# Altium project controller.PrjPcb
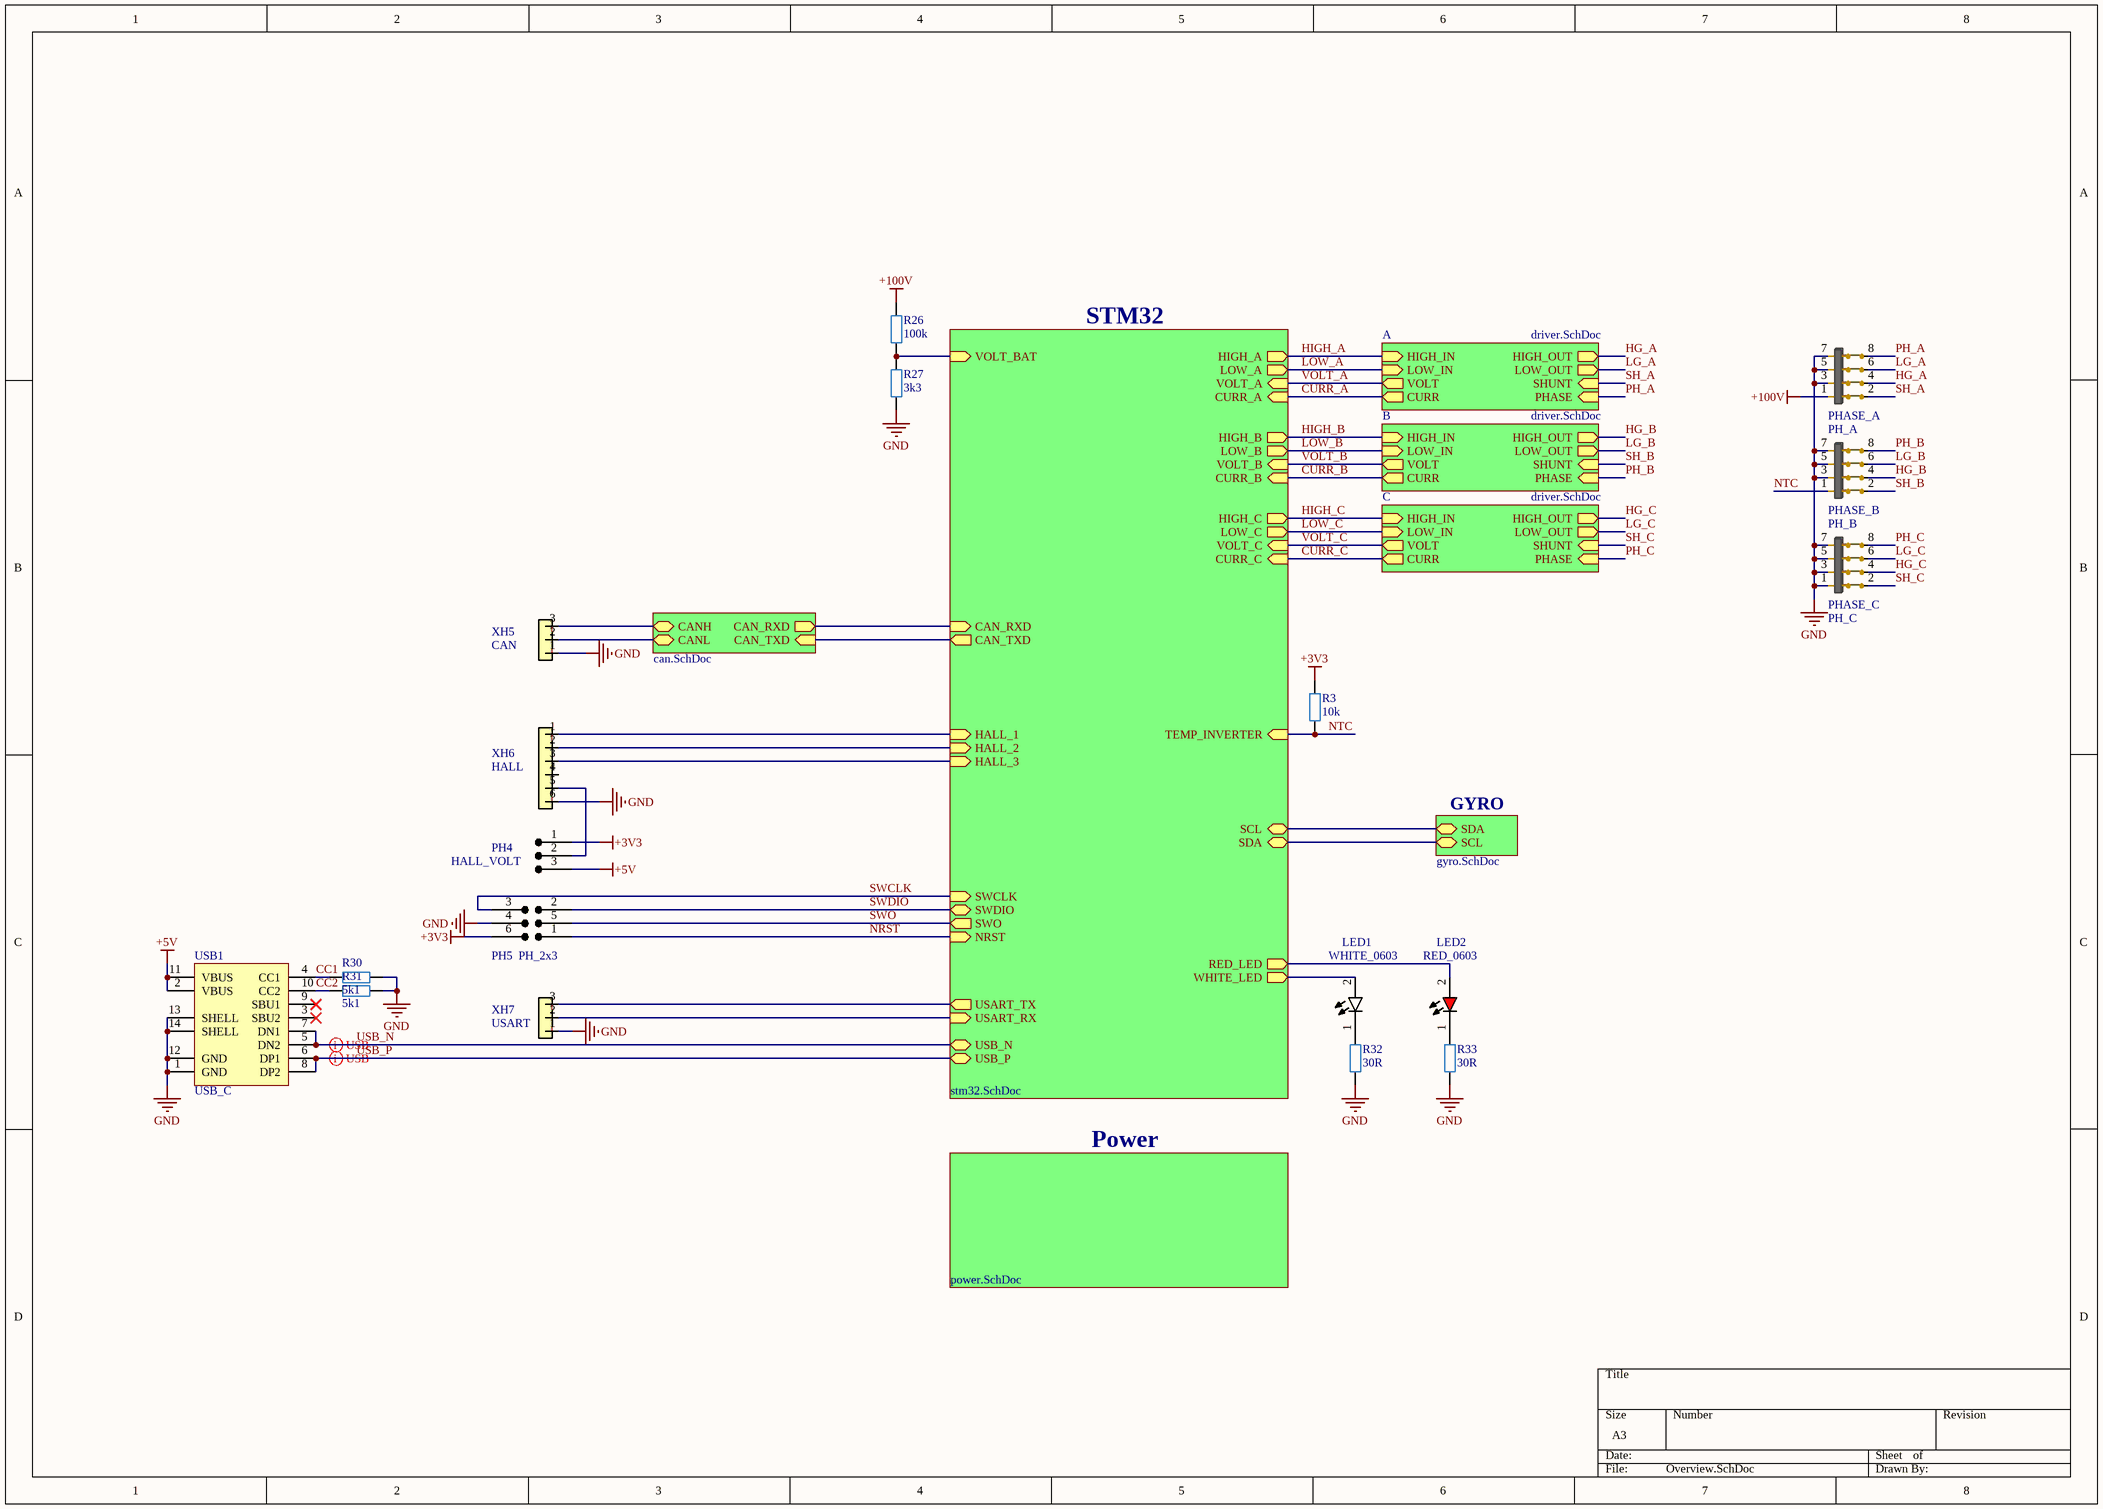
[diagram p0: Overview.SchDoc]
6 sheets, 84 parts. Net scope: hierarchical (ports join the sheet entries above them; power ports are global).
Board file: controllerboard.PcbDoc
Sheets:
  Overview.SchDoc
    STM32 = stm32.SchDoc
    CAN = can.SchDoc
    Power = power.SchDoc
    A = driver.SchDoc
    B = driver.SchDoc
    C = driver.SchDoc
    GYRO = gyro.SchDoc

## Sheet Overview.SchDoc
size A3; SheetNumber: 1; SheetTotal: 6

### Parts
LED1  WHITE_0603  [WHITE_0603]
LED2  RED_0603  [RED_0603]
PH4  HALL_VOLT  [PH_1x3]
PH5  PH_2x3  [PH_2x3]
PH_A  PHASE_A  [PH_2x4_M]
PH_B  PHASE_B  [PH_2x4_M]
PH_C  PHASE_C  [PH_2x4_M]
R3  10k  [RES_0603]
R26  100k  [RES_0603]
R27  3k3  [RES_0603]
R30  5k1  [RES_0603]
R31  5k1  [RES_0603]
R32  30R  [RES_0603]
R33  30R  [RES_0603]
USB1  USB_C  [USB_C]
XH5  CAN  [XY-XHB2.54-3A21]
XH6  HALL  [XY-XHB2.54-6A21]
XH7  USART  [XY-XHB2.54-3A21]

### Sub-sheets
A = driver.SchDoc: HIGH_IN (in), LOW_IN (in), HIGH_OUT (out), LOW_OUT (out), VOLT (out), SHUNT (in), PHASE (in), CURR (out)
B = driver.SchDoc: HIGH_IN (in), LOW_IN (in), HIGH_OUT (out), LOW_OUT (out), VOLT (out), SHUNT (in), PHASE (in), CURR (out)
C = driver.SchDoc: HIGH_IN (in), LOW_IN (in), HIGH_OUT (out), LOW_OUT (out), VOLT (out), SHUNT (in), PHASE (in), CURR (out)
CAN = can.SchDoc: CAN_TXD (in), CAN_RXD (out), CANH (bidir), CANL (bidir)
GYRO = gyro.SchDoc: SDA (bidir), SCL (bidir)
Power = power.SchDoc: no entries
STM32 = stm32.SchDoc: VOLT_A (in), VOLT_B (in), VOLT_C (in), CURR_A (in), CURR_B (in), CURR_C (in), HIGH_A (out), HIGH_B (out), HIGH_C (out), LOW_A (out), LOW_B (out), HALL_1 (in), HALL_2 (in), CAN_RXD (in), USART_RX (in), RED_LED (out), WHITE_LED (out), SWO (out), HALL_3 (in), USB_N (bidir), USB_P (bidir), SWDIO (bidir), NRST (in), CAN_TXD (out), USART_TX (out), SWCLK (in), VOLT_BAT (in), TEMP_INVERTER (in), LOW_C (out), SCL (bidir), SDA (bidir)

### Nets
+3V3: PH4.1 PH5.6 R3.2
+5V: PH4.3 USB1.2(VBUS) USB1.11(VBUS)
+100V: PH_A.1 R26.2
GND: PH5.4 PH_A.3 PH_A.5 PH_A.7 PH_B.3 PH_B.5 PH_B.7 PH_C.1 PH_C.3 PH_C.5 PH_C.7 R27.1 R30.2 R31.2 R32.1 R33.1 USB1.1(GND) USB1.12(GND) USB1.13(SHELL) USB1.14(SHELL) XH5.1 XH6.6 XH7.1
CAN_RXD: sheet STM32/CAN_RXD, sheet CAN/CAN_RXD
CAN_TXD: sheet STM32/CAN_TXD, sheet CAN/CAN_TXD
CANH: XH5.3 ; sheet CAN/CANH
CANL: XH5.2 ; sheet CAN/CANL
CC1: R30.1 USB1.4(CC1)
CC2: R31.1 USB1.10(CC2)
CURR_A: sheet STM32/CURR_A, sheet A/CURR
CURR_B: sheet STM32/CURR_B, sheet B/CURR
CURR_C: sheet STM32/CURR_C, sheet C/CURR
HG_A: PH_A.4 ; sheet A/HIGH_OUT
HG_B: PH_B.4 ; sheet B/HIGH_OUT
HG_C: PH_C.4 ; sheet C/HIGH_OUT
HIGH_A: sheet STM32/HIGH_A, sheet A/HIGH_IN
HIGH_B: sheet STM32/HIGH_B, sheet B/HIGH_IN
HIGH_C: sheet STM32/HIGH_C, sheet C/HIGH_IN
LG_A: PH_A.6 ; sheet A/LOW_OUT
LG_B: PH_B.6 ; sheet B/LOW_OUT
LG_C: PH_C.6 ; sheet C/LOW_OUT
LOW_A: sheet STM32/LOW_A, sheet A/LOW_IN
LOW_B: sheet STM32/LOW_B, sheet B/LOW_IN
LOW_C: sheet STM32/LOW_C, sheet C/LOW_IN
NRST: PH5.1 ; sheet STM32/NRST
NTC: PH_B.1 R3.1 ; sheet STM32/TEMP_INVERTER
PH_A: PH_A.8 ; sheet A/PHASE
PH_B: PH_B.8 ; sheet B/PHASE
PH_C: PH_C.8 ; sheet C/PHASE
SH_A: PH_A.2 ; sheet A/SHUNT  [project net SH]
SH_B: PH_B.2 ; sheet B/SHUNT  [project net SH]
SH_C: PH_C.2 ; sheet C/SHUNT  [project net SH]
SWCLK: PH5.3 ; sheet STM32/SWCLK
SWDIO: PH5.2 ; sheet STM32/SWDIO
SWO: PH5.5 ; sheet STM32/SWO
USB_N: USB1.5(DN2) USB1.7(DN1) ; sheet STM32/USB_N
USB_P: USB1.6(DP1) USB1.8(DP2) ; sheet STM32/USB_P
VOLT_A: sheet STM32/VOLT_A, sheet A/VOLT
VOLT_B: sheet STM32/VOLT_B, sheet B/VOLT
VOLT_C: sheet STM32/VOLT_C, sheet C/VOLT
NetLED1_1: LED1.1(K) R32.2
NetLED1_2: LED1.2(A) ; sheet STM32/WHITE_LED
NetLED2_1: LED2.1(K) R33.2
NetLED2_2: LED2.2(A) ; sheet STM32/RED_LED
NetPH4_2: PH4.2 XH6.5
NetR26_1: R26.1 R27.2 ; sheet STM32/VOLT_BAT
NetU1_18: XH6.1 ; sheet STM32/HALL_1
NetU1_19: XH6.2 ; sheet STM32/HALL_2
NetU1_20: XH6.3 ; sheet STM32/HALL_3
NetU1_21: sheet STM32/SCL, sheet GYRO/SDA
NetU1_22: sheet STM32/SDA, sheet GYRO/SCL
NetU1_42: XH7.3 ; sheet STM32/USART_TX
NetU1_43: XH7.2 ; sheet STM32/USART_RX

Not connected (* = marked no-connect by the designer): USB1 3(SBU2)* 9(SBU1)*; XH6 4

### Layout directives
differential pair: USB_N, USB_P

### Library data of the parts
LED1 = WHITE_0603: 20mA 780mcd Yellow lens -20℃~+85℃ Positive Stick White 130° 70mW 3.3V 0603 LED Indication - Discrete ROHS; Mfr.: XINGLIGHT; Mfr. Part: XL-1608WWC-06; LCSC: C965810; Package: 0603
LED2 = RED_0603: 20mA 330mcd Colorless Transparent Lens -20℃~+85℃ Positive Stick 620nm~630nm Red 120° 50mW 2.3V 0603 LED Indication - Discrete ROHS; Mfr.: XINGLIGHT; Mfr. Part: XL-1608SURC-06; LCSC: C965799; Package: 0603
PH4 = PH_1x3: 2.54mm Pin Headers; Mfr. Part: 2.54-1*3P; Mfr.: BOOMELE(Boom Precision Elec); LCSC: C49257; Package: Plugin,P=2.54mm
PH5 = PH_2x3: 2.54mm Pin Headers
PH_A PH_B PH_C = PH_2x4_M: Policy 2.5mm 8P 6mm -40℃~+105℃ 2.54mm Double Row Black Brass 2x4P Push-Pull,P=2.54mm Pin Headers ROHS; Mfr. Part: PH2.54-07-04PWS; Mfr.: XUNPU; LCSC: C7501618
  PH_A: ClassName: A
  PH_B: ClassName: B
  PH_C: ClassName: C
R3 R26 R27 R30-R33 = RES_0603: 100mW Thick Film Resistors; Voltage Rating: *; Mfr. Part: *; Package: 0603; LCSC: *; Mfr.: *
USB1 = USB_C: Mfr. Part: TYPE-C 16PIN 2MD(073); Mfr.: SHOU HAN; LCSC: C2765186; Package: SMD
XH5 XH7 = XY-XHB2.54-3A21: 1x3P 3P 1 2.54mm 2.54mm 3 -25℃~+85℃ 2A Bend-in Push-Pull,P=2.54mm Wire To Board Connector ROHS; Mfr.: XYECONN; Mfr. Part: XY-XHB2.54-3A21; LCSC: C19271396
XH6 = XY-XHB2.54-6A21: 1x6P 6P 1 2.54mm 2.54mm 6 -25℃~+85℃ 2A Bend-in Push-Pull,P=2.54mm Wire To Board Connector ROHS; Mfr.: XYECONN; Mfr. Part: XY-XHB2.54-6A21; LCSC: C19271399

## Sheet stm32.SchDoc
size A3; SheetNumber: 2; SheetTotal: 6
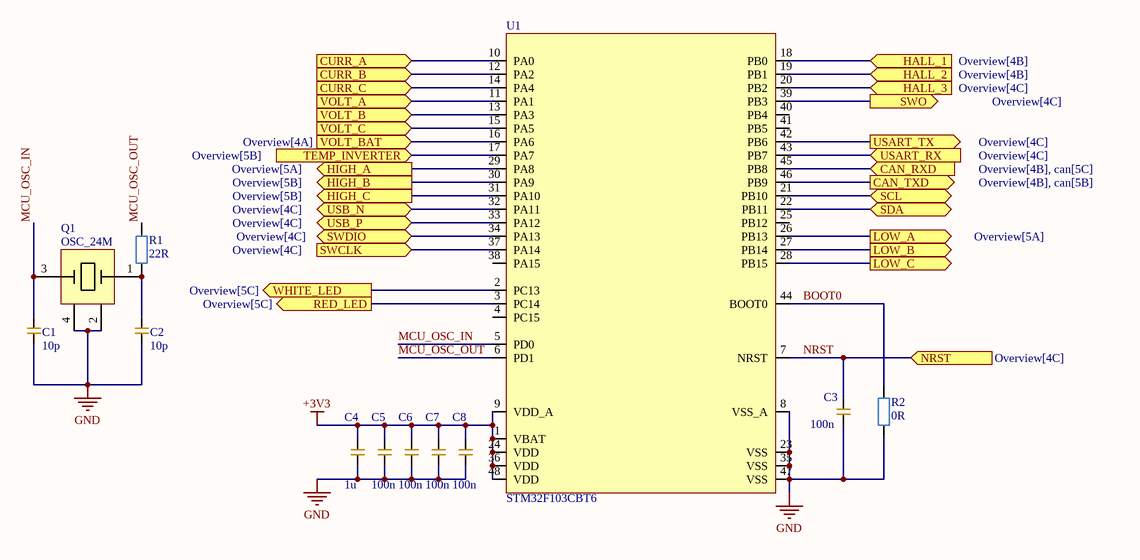
[diagram p1: stm32.SchDoc]

### Parts
C1  10p  [CAP_0603]
C2  10p  [CAP_0603]
C3  100n  [CAP_0603]
C4  1u  [CAP_0603]
C5  100n  [CAP_0603]
C6  100n  [CAP_0603]
C7  100n  [CAP_0603]
C8  100n  [CAP_0603]
Q1  OSC_24M  [OSC_24M]
R1  22R  [RES_0603]
R2  0R  [RES_0603]
U1  STM32F103CBT6  [STM32F103CBT6]

### Ports
CAN_RXD (in, see Overview[4B], can[5C]), CAN_TXD (out, see Overview[4B], can[5B]), CURR_A (in, see Overview[5B]), CURR_B (in, see Overview[5B]), CURR_C (in, see Overview[5B]), HALL_1 (in, see Overview[4B]), HALL_2 (in, see Overview[4B]), HALL_3 (in, see Overview[4C]), HIGH_A (out, see Overview[5A]), HIGH_B (out, see Overview[5B]), HIGH_C (out, see Overview[5B]), LOW_A (out, see Overview[5A]), LOW_B (out, see Overview[5B]), LOW_C (out, see Overview[5B]), NRST (in, see Overview[4C]), RED_LED (out, see Overview[5C]), SCL (bidir), SDA (bidir), SWCLK (in, see Overview[4C]), SWDIO (bidir, see Overview[4C]), SWO (out, see Overview[4C]), TEMP_INVERTER (in, see Overview[5B]), USART_RX (in, see Overview[4C]), USART_TX (out, see Overview[4C]), USB_N (bidir, see Overview[4C]), USB_P (bidir, see Overview[4C]), VOLT_A (in, see Overview[5B]), VOLT_B (in, see Overview[5B]), VOLT_BAT (in, see Overview[4A]), VOLT_C (in, see Overview[5B]), WHITE_LED (out, see Overview[5C])

### Nets
+3V3: C4.2 C5.2 C6.2 C7.2 C8.2 U1.1(VBAT) U1.9(VDD_A) U1.24(VDD) U1.36(VDD) U1.48(VDD)
GND: C1.1 C2.1 C3.1 C4.1 C5.1 C6.1 C7.1 C8.1 Q1.2 Q1.4 R2.1 U1.8(VSS_A) U1.23(VSS) U1.35(VSS) U1.47(VSS)
BOOT0: R2.2 U1.44(BOOT0)
CAN_RXD: U1.45(PB8) ; port CAN_RXD
CAN_TXD: U1.46(PB9) ; port CAN_TXD
CURR_A: U1.10(PA0) ; port CURR_A
CURR_B: U1.12(PA2) ; port CURR_B
CURR_C: U1.14(PA4) ; port CURR_C
HIGH_A: U1.29(PA8) ; port HIGH_A
HIGH_B: U1.30(PA9) ; port HIGH_B
HIGH_C: U1.31(PA10) ; port HIGH_C
LOW_A: U1.26(PB13) ; port LOW_A
LOW_B: U1.27(PB14) ; port LOW_B
LOW_C: U1.28(PB15) ; port LOW_C
MCU_OSC_IN: C1.2 Q1.3 U1.5(PD0)
MCU_OSC_OUT: R1.2 U1.6(PD1)
NRST: C3.2 U1.7(NRST) ; port NRST
NTC: U1.17(PA7) ; port TEMP_INVERTER
SWCLK: U1.37(PA14) ; port SWCLK
SWDIO: U1.34(PA13) ; port SWDIO
SWO: U1.39(PB3) ; port SWO
USB_N: U1.32(PA11) ; port USB_N
USB_P: U1.33(PA12) ; port USB_P
VOLT_A: U1.11(PA1) ; port VOLT_A
VOLT_B: U1.13(PA3) ; port VOLT_B
VOLT_C: U1.15(PA5) ; port VOLT_C
NetC2_2: C2.2 Q1.1 R1.1
NetLED1_2: U1.2(PC13) ; port WHITE_LED
NetLED2_2: U1.3(PC14) ; port RED_LED
NetR26_1: U1.16(PA6) ; port VOLT_BAT
NetU1_18: U1.18(PB0) ; port HALL_1
NetU1_19: U1.19(PB1) ; port HALL_2
NetU1_20: U1.20(PB2) ; port HALL_3
NetU1_21: U1.21(PB10) ; port SCL
NetU1_22: U1.22(PB11) ; port SDA
NetU1_42: U1.42(PB6) ; port USART_TX
NetU1_43: U1.43(PB7) ; port USART_RX

Not connected (* = marked no-connect by the designer): U1 4(PC15) 25(PB12) 38(PA15) 40(PB4) 41(PB5)

### Library data of the parts
C1-C8 = CAP_0603: Multilayer Ceramic Capacitors MLCC - SMD/SMT ROHS; Mfr.: *; Voltage Rating: *; Package: 0603; LCSC: *; Mfr. Part: *
Q1 = OSC_24M: Crystal 24Mhz; Manufacturer Part: X322524MOB4SI; LCSC: C70590; ComponentLink1Description: Datasheet; ComponentLink1URL: https://www.lcsc.com/datasheet/lcsc_datasheet_2403291504_YXC-Crystal-Oscillators-X322524MOB4SI_C70590.pdf
R1 R2 = RES_0603: 100mW Thick Film Resistors; Voltage Rating: *; Mfr. Part: *; Package: 0603; LCSC: *; Mfr.: *
U1 = STM32F103CBT6: Mainstream enhanced ARM Cortex-M3 MCU, featuring 128 KB Flash, 72 MHz CPU, motor control, USB, and CAN.; Mfr.: STMicroelectronics; Mfr. Part: STM32F103CBT6; LCSC: C8304

## Sheet can.SchDoc
size A3; SheetNumber: 5; SheetTotal: 6
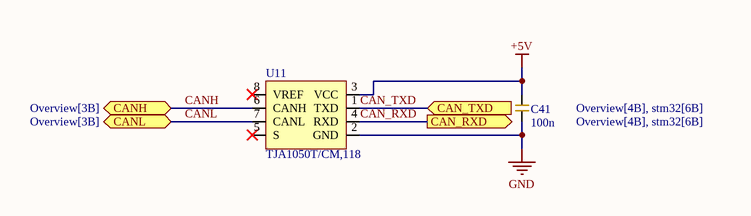
[diagram p2: can.SchDoc]

### Parts
C41  100n  [CAP_0603]
U11  TJA1050T/CM,118  [TJA1050T/CM,118]

### Ports
CAN_RXD (out, see Overview[4B], stm32[6B]), CAN_TXD (in, see Overview[4B], stm32[6B]), CANH (bidir, see Overview[3B]), CANL (bidir, see Overview[3B])

### Nets
+5V: C41.2 U11.3(VCC)
GND: C41.1 U11.2(GND)
CAN_RXD: U11.4(RXD) ; port CAN_RXD
CAN_TXD: U11.1(TXD) ; port CAN_TXD
CANH: U11.6(CANH) ; port CANH
CANL: U11.7(CANL) ; port CANL

Not connected (* = marked no-connect by the designer): U11 5(S)* 8(VREF)*

### Library data of the parts
C41 = CAP_0603: as C1 on sheet stm32; Mfr.: *; Voltage Rating: *; Package: 0603; LCSC: *; Mfr. Part: *
U11 = TJA1050T/CM,118: SOP-8 CAN Transceivers ROHS; Mfr.: NXP Semicon; Mfr. Part: TJA1050T/CM,118; LCSC: C6952

## Sheet power.SchDoc
size A3; SheetNumber: 3; SheetTotal: 5
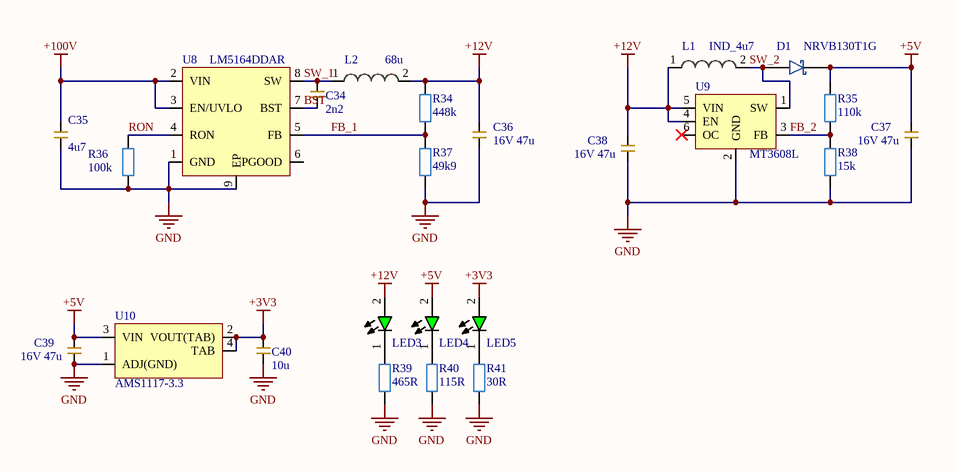
[diagram p3: power.SchDoc]

### Parts
C34  2n2  [CAP_0603]
C35  4u7  [FS32X475K101EGG]
C36  16V 47u  [CAP_1210]
C37  16V 47u  [CAP_1210]
C38  16V 47u  [CAP_1210]
C39  16V 47u  [CAP_1210]
C40  10u  [CAP_0603]
D1  NRVB130T1G  [NRVB130T1G]
L1  IND_4u7  [FTC252010S4R7MBCA]
L2  68u  [SMMS0650-680M]
LED3  GREEN_0603  [GREEN_0603]  (value not drawn)
LED4  GREEN_0603  [GREEN_0603]  (value not drawn)
LED5  GREEN_0603  [GREEN_0603]  (value not drawn)
R34  448k  [RES_0603]
R35  110k  [RES_0603]
R36  100k  [RES_0603]
R37  49k9  [RES_0603]
R38  15k  [RES_0603]
R39  465R  [RES_0603]
R40  115R  [RES_0603]
R41  30R  [RES_0603]
U8  LM5164DDAR  [LM5164DDAR]
U9  MT3608L  [MT3608L]
U10  AMS1117-3.3  [AMS1117-3.3]

### Nets
+3V3: C40.2 LED5.2(A) U10.2(VOUT(TAB)) U10.4(TAB)
+5V: C37.2 C39.2 D1.1 LED4.2(A) R35.2 U10.3(VIN)
+12V: C36.2 C38.2 L1.1 L2.2 LED3.2(A) R34.2 U9.4(EN) U9.5(VIN)
+100V: C35.2 U8.2(VIN) U8.3(EN/UVLO)
GND: C35.1 C36.1 C37.1 C38.1 C39.1 C40.1 R36.1 R37.1 R38.1 R39.1 R40.1 R41.1 U8.1(GND) U8.9(EP) U9.2(GND) U10.1(ADJ(GND))
BST: C34.1 U8.7(BST)
FB_1: R34.1 R37.2 U8.5(FB)
FB_2: R35.1 R38.2 U9.3(FB)
RON: R36.2 U8.4(RON)
SW_1: C34.2 L2.1 U8.8(SW)
SW_2: D1.2 L1.2 U9.1(SW)
NetLED3_1: LED3.1(K) R39.2
NetLED4_1: LED4.1(K) R40.2
NetLED5_1: LED5.1(K) R41.2

Not connected (* = marked no-connect by the designer): U8 6(PGOOD); U9 6(OC)*

### Library data of the parts
C34 C40 = CAP_0603: as C1 on sheet stm32; Mfr.: *; Voltage Rating: *; Package: 0603; LCSC: *; Mfr. Part: *
  C34: ClassName: DCDC100
  C40: ClassName: LINREG
C35 = 4u7: 100V 4.7uF X7R ±10% 1210 Multilayer Ceramic Capacitors MLCC - SMD/SMT ROHS; Mfr.: PSA(Prosperity Dielectrics); Voltage Rating: 100V; Package: 1210; LCSC: C381466; Mfr. Part: FS32X475K101EGG; ClassName: DCDC100
C36-C39 = CAP_1210: 16V 47uF X5R ±10% 1210 Multilayer Ceramic Capacitors MLCC - SMD/SMT ROHS; Mfr.: Murata Electronics; Mfr. Part: GRM32ER61C476KE15L; Voltage Rating: 16V; Package: 1210; LCSC: C77101
  C36: ClassName: DCDC100
  C37 C38: ClassName: DCDC5
  C39: ClassName: LINREG
D1 = NRVB130T1G: 30V 1A 350mV@100mA SOD-123 Schottky Diodes ROHS; Mfr.: JSMSEMI; LCSC: C917121; Mfr. Part: NRVB130T1G; ClassName: DCDC5
L1 = IND_4u7: 2A 4.7uH Integrated molded inductor ±20% 2.6A SMD,2x2.5mm Power Inductors ROHS; Mfr.: cjiang (Changjiang Microelectronics Tech); Mfr. Part: FTC252010S4R7MBCA; LCSC: C5832360; Package: SMD,2x2.5mm; ClassName: DCDC5
L2 = IND_68u: 1.5A 68uH Integrated molded inductor ±20% 2A SMD,6.6x7.1mm Power Inductors ROHS; Mfr.: SXN(Shun Xiang Nuo Elec); Mfr. Part: SMMS0650-680M; LCSC: C2894721; Package: SMD,6.6x7.1mm; ClassName: DCDC100
LED3-LED5 = GREEN_0603: 20mA 810mcd Colorless Transparent Lens Independent Diode 515nm~535nm -20℃~+85℃ Positive Stick Emerald 120° 70mW 3.3V 0603 LED Indication - Discrete ROHS; Mfr.: XINGLIGHT; Mfr. Part: XL-1608UGC-04; LCSC: C965804; Package: 0603
R34-R41 = RES_0603: 100mW Thick Film Resistors; Voltage Rating: *; Mfr. Part: *; Package: 0603; LCSC: *; Mfr.: *
  R34 R36 R37: ClassName: DCDC100
  R35 R38: ClassName: DCDC5
U8 = LM5164DDAR: Step-down type 1A 6V~100V SO-8-EP DC-DC Converters ROHS; Mfr.: Texas Instruments; Mfr. Part: LM5164DDAR; LCSC: C477928; ClassName: DCDC100
U9 = MT3608L: 2.2V~16V 2.5A SOT-23-6 DC-DC Converters ROHS; Mfr.: XI'AN Aerosemi Tech; Mfr. Part: MT3608L; LCSC: C2932326; ClassName: DCDC5
U10 = AMS1117-3.3: 1A 60dB@(120Hz) Fixed 3.3V Positive electrode 12V SOT-223 Voltage Regulators - Linear, Low Drop Out (LDO) Regulators ROHS; Mfr.: UMW(Youtai Semiconductor Co., Ltd.); Mfr. Part: AMS1117-3.3; LCSC: C347222; ClassName: LINREG

## Sheet driver.SchDoc
size A3; SheetNumber: 5; SheetTotal: 6
Used 3 times, as channels A, B, C. Parts and nets are listed once, with the designators drawn on the sheet.
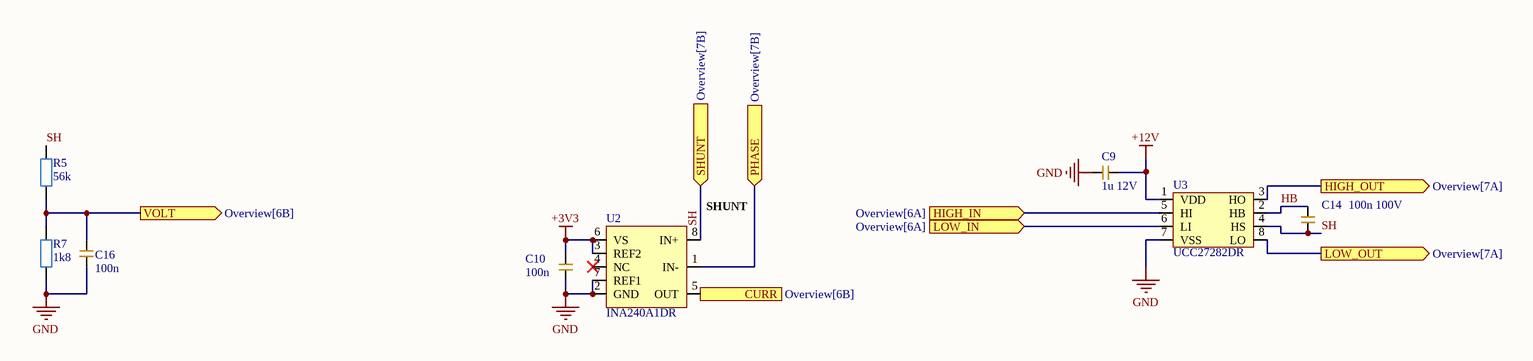
[diagram p4: driver.SchDoc]

### Parts
C9  1u 12V  [CAP_0603]
C10  100n  [CAP_0603]
C14  100n 100V  [CAP_0603]
C16  100n  [CAP_0603]
R5  56k  [RES_0603]
R7  1k8  [RES_0603]
U2  INA240A1DR  [INA240A1DR]
U3  UCC27282DR  [UCC27282DR]

### Ports
CURR (out, see Overview[6B]), HIGH_IN (in, see Overview[6A]), HIGH_OUT (out, see Overview[7A]), LOW_IN (in, see Overview[6A]), LOW_OUT (out, see Overview[7A]), PHASE (in, see Overview[7B]), SHUNT (in, see Overview[7B]), VOLT (out, see Overview[6B])

### Nets
+3V3: C10.2 U2.3(REF2) U2.6(VS)
+12V: C9.1 U3.1(VDD)
GND: C9.2 C10.1 C16.1 R7.1 U2.2(GND) U2.7(REF1) U3.7(VSS)
CURR: U2.5(OUT) ; port CURR
HB: C14.2 U3.2(HB)
HIGH_IN: U3.5(HI) ; port HIGH_IN
HIGH_OUT: U3.3(HO) ; port HIGH_OUT
LOW_IN: U3.6(LI) ; port LOW_IN
LOW_OUT: U3.8(LO) ; port LOW_OUT
PHASE: U2.1(IN-) ; port PHASE
SH: C14.1 R5.2 U2.8(IN+) U3.4(HS) ; port SHUNT
VOLT: C16.2 R5.1 R7.2 ; port VOLT

Not connected (* = marked no-connect by the designer): U2 4(NC)*

### Channels
A: designators end in _A; ports CURR=CURR_A HIGH_IN=HIGH_A HIGH_OUT=HG_A LOW_IN=LOW_A LOW_OUT=LG_A PHASE=PH_A SHUNT=SH VOLT=VOLT_A
B: designators end in _B; ports CURR=CURR_B HIGH_IN=HIGH_B HIGH_OUT=HG_B LOW_IN=LOW_B LOW_OUT=LG_B PHASE=PH_B SHUNT=SH VOLT=VOLT_B
C: designators end in _C; ports CURR=CURR_C HIGH_IN=HIGH_C HIGH_OUT=HG_C LOW_IN=LOW_C LOW_OUT=LG_C PHASE=PH_C SHUNT=SH VOLT=VOLT_C

### Notes on the sheet
- (near U2) SHUNT

### Library data of the parts
C9 C10 C14 C16 = CAP_0603: as C1 on sheet stm32; Mfr.: *; Voltage Rating: *; Package: 0603; LCSC: *; Mfr. Part: *
R5 R7 = RES_0603: 100mW Thick Film Resistors; Voltage Rating: *; Mfr. Part: *; Package: 0603; LCSC: *; Mfr.: *
U2 = INA240A1DR: -4V~80V Single channel SOIC-8 Current Sense Amplifiers ROHS; Mfr.: Texas Instruments; Mfr. Part: INA240A1DR; LCSC: C2060769
U3 = UCC27282DR: Half Bridge 2 MOSFET 2.5A 12ns 10ns 5.5V~16V 3.5A SOIC-8 Gate Drivers ROHS; Mfr.: Texas Instruments; Mfr. Part: UCC27282DR; LCSC: C2867844

## Sheet gyro.SchDoc
size A4; SheetNumber: 6; SheetTotal: 6
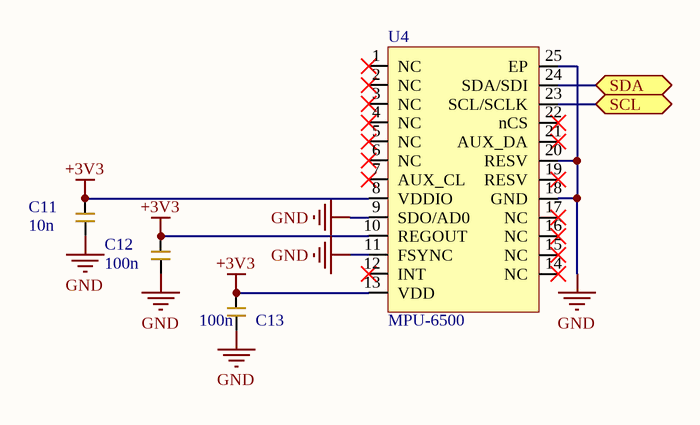
[diagram p5: gyro.SchDoc]

### Parts
C11  10n  [CAP_0603]
C12  100n  [CAP_0603]
C13  100n  [CAP_0603]
U4  MPU-6500  [MPU-6500]

### Ports
SCL (bidir), SDA (bidir)

### Nets
+3V3: C11.2 C12.2 C13.2 U4.8(VDDIO) U4.10(REGOUT) U4.13(VDD)
GND: C11.1 C12.1 C13.1 U4.9(SDO/AD0) U4.11(FSYNC) U4.18(GND) U4.20(RESV) U4.25(EP)
NetU1_21: U4.24(SDA/SDI) ; port SDA
NetU1_22: U4.23(SCL/SCLK) ; port SCL

Not connected (* = marked no-connect by the designer): U4 1(NC)* 2(NC)* 3(NC)* 4(NC)* 5(NC)* 6(NC)* 7(AUX_CL)* 12(INT)* 14(NC)* 15(NC)* 16(NC)* 17(NC)* 19(RESV)* 21(AUX_DA)* 22(nCS)*

### Library data of the parts
C11-C13 = CAP_0603: as C1 on sheet stm32; Mfr.: *; Voltage Rating: *; Package: 0603; LCSC: *; Mfr. Part: *
U4 = MPU-6500: Accelerometer gyroscope QFN-24-EP(3x3) Accelerometers ROHS; Mfr.: TDK InvenSense; LCSC: C50278; Mfr. Part: MPU-6500

## Nets that join several sheets
+3V3: Overview (PH4.1 PH5.6 R3.2), stm32 (10 pins), power (C40.2 LED5.2 U10.2 U10.4), A (C10_A.2 U2_A.3 U2_A.6), B (C10_B.2 U2_B.3 U2_B.6), C (C10_C.2 U2_C.3 U2_C.6), gyro (6 pins)
+5V: Overview (PH4.3 USB1.2 USB1.11), can (C41.2 U11.3), power (6 pins)
+12V: power (8 pins), A (C9_A.1 U3_A.1), B (C9_B.1 U3_B.1), C (C9_C.1 U3_C.1)
+100V: Overview (PH_A.1 R26.2), power (C35.2 U8.2 U8.3)
GND: Overview (23 pins), stm32 (15 pins), can (C41.1 U11.2), power (16 pins), A (7 pins), B (7 pins), C (7 pins), gyro (8 pins)
CAN_RXD: stm32 (U1.45), can (U11.4)
CAN_TXD: stm32 (U1.46), can (U11.1)
CANH: Overview (XH5.3), can (U11.6)
CANL: Overview (XH5.2), can (U11.7)
CURR_A: stm32 (U1.10), A (U2_A.5)
CURR_B: stm32 (U1.12), B (U2_B.5)
CURR_C: stm32 (U1.14), C (U2_C.5)
HG_A: Overview (PH_A.4), A (U3_A.3)
HG_B: Overview (PH_B.4), B (U3_B.3)
HG_C: Overview (PH_C.4), C (U3_C.3)
HIGH_A: stm32 (U1.29), A (U3_A.5)
HIGH_B: stm32 (U1.30), B (U3_B.5)
HIGH_C: stm32 (U1.31), C (U3_C.5)
LG_A: Overview (PH_A.6), A (U3_A.8)
LG_B: Overview (PH_B.6), B (U3_B.8)
LG_C: Overview (PH_C.6), C (U3_C.8)
LOW_A: stm32 (U1.26), A (U3_A.6)
LOW_B: stm32 (U1.27), B (U3_B.6)
LOW_C: stm32 (U1.28), C (U3_C.6)
NetLED1_2: Overview (LED1.2), stm32 (U1.2)
NetLED2_2: Overview (LED2.2), stm32 (U1.3)
NetR26_1: Overview (R26.1 R27.2), stm32 (U1.16)
NetU1_18: Overview (XH6.1), stm32 (U1.18)
NetU1_19: Overview (XH6.2), stm32 (U1.19)
NetU1_20: Overview (XH6.3), stm32 (U1.20)
NetU1_21: stm32 (U1.21), gyro (U4.24)
NetU1_22: stm32 (U1.22), gyro (U4.23)
NetU1_42: Overview (XH7.3), stm32 (U1.42)
NetU1_43: Overview (XH7.2), stm32 (U1.43)
NRST: Overview (PH5.1), stm32 (C3.2 U1.7)
NTC: Overview (PH_B.1 R3.1), stm32 (U1.17)
PH_A: Overview (PH_A.8), A (U2_A.1)
PH_B: Overview (PH_B.8), B (U2_B.1)
PH_C: Overview (PH_C.8), C (U2_C.1)
SH: Overview (PH_A.2), A (C14_A.1 R5_A.2 U2_A.8 U3_A.4)
SH: Overview (PH_B.2), B (C14_B.1 R5_B.2 U2_B.8 U3_B.4)
SH: Overview (PH_C.2), C (C14_C.1 R5_C.2 U2_C.8 U3_C.4)
SWCLK: Overview (PH5.3), stm32 (U1.37)
SWDIO: Overview (PH5.2), stm32 (U1.34)
SWO: Overview (PH5.5), stm32 (U1.39)
USB_N: Overview (USB1.5 USB1.7), stm32 (U1.32)
USB_P: Overview (USB1.6 USB1.8), stm32 (U1.33)
VOLT_A: stm32 (U1.11), A (C16_A.2 R5_A.1 R7_A.2)
VOLT_B: stm32 (U1.13), B (C16_B.2 R5_B.1 R7_B.2)
VOLT_C: stm32 (U1.15), C (C16_C.2 R5_C.1 R7_C.2)